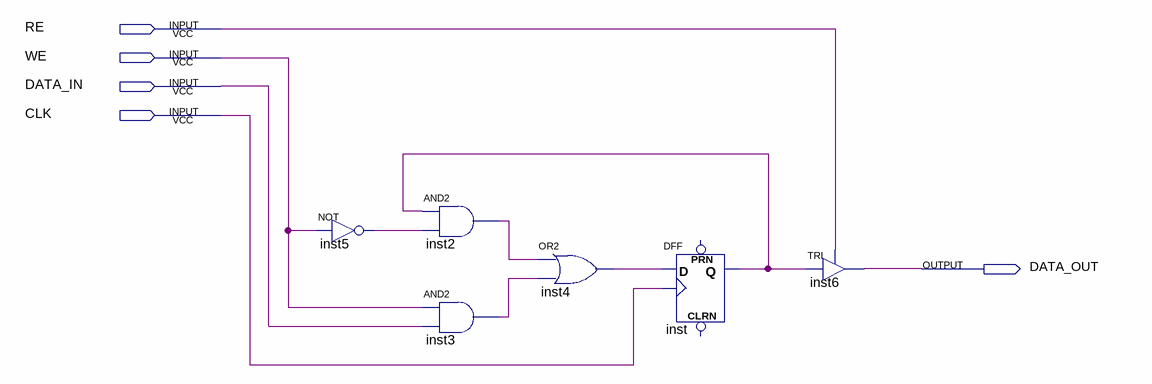
[diagram p0: schematic sheet]
// Quartus schematic Register_cell.bdf as structural Verilog: 6 symbols, 5 pins
module Register_cell (
  input  RE,
  input  WE,
  input  DATA_IN,
  input  CLK,
  output DATA_OUT
);

  wire inst2_out, inst3_out, inst4_out, inst5_out, inst_q;

  not inst5 (inst5_out, WE);
  and inst2 (inst2_out, inst_q, inst5_out);
  and inst3 (inst3_out, WE, DATA_IN);
  or inst4 (inst4_out, inst2_out, inst3_out);
  DFF inst (.CLK(CLK), .D(inst4_out), .Q(inst_q));  // open: CLRN, PRN
  TRI inst6 (.IN(inst_q), .OE(RE), .OUT(DATA_OUT));
endmodule
